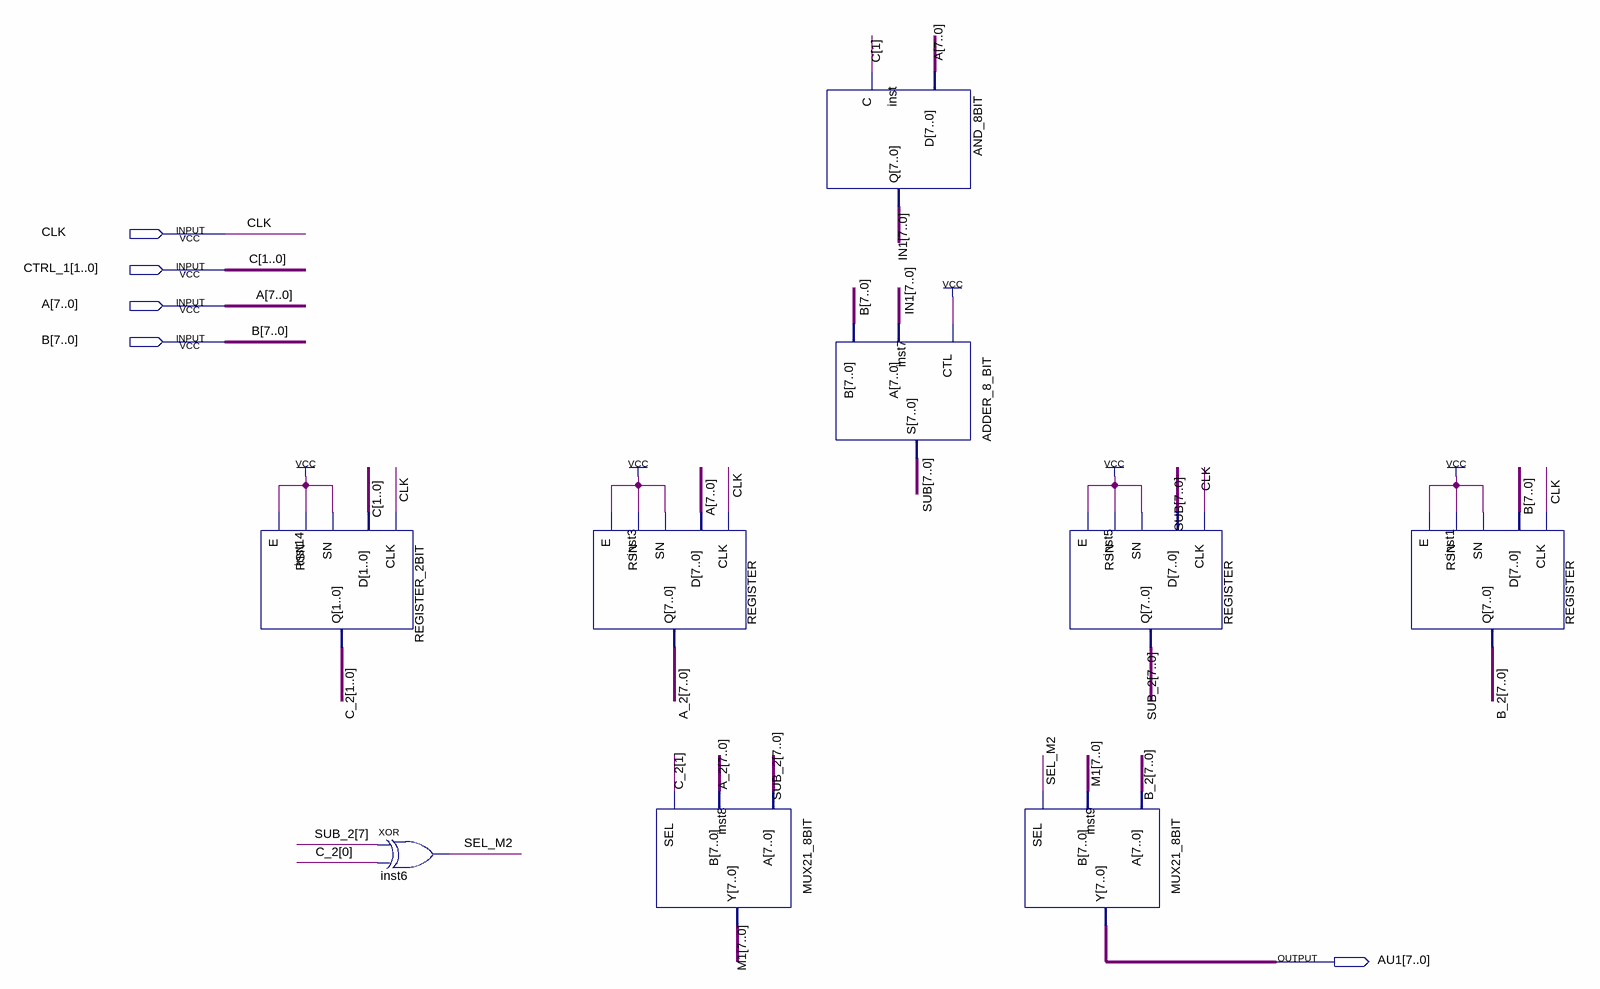
[diagram p0: schematic sheet]
// Quartus schematic AU1.bdf as structural Verilog: 9 symbols, 5 pins
module AU1 (
  input  CLK,
  input  [1:0] CTRL_1,
  input  [7:0] A,
  input  [7:0] B,
  output [7:0] AU1
);

  wire SEL_M2;
  wire [1:0] C_2;
  wire [7:0] A_2, B_2, IN1, M1, SUB, SUB_2;

  REGISTER_2BIT inst14 (.CLK(CLK), .D(CTRL_1), .SN(1'b1), .RSN(1'b1), .E(1'b1), .Q(C_2));
  xor inst6 (SEL_M2, SUB_2[7], C_2[0]);
  REGISTER inst3 (.CLK(CLK), .D(A), .SN(1'b1), .RSN(1'b1), .E(1'b1), .Q(A_2));
  MUX21_8BIT inst8 (.A(SUB_2), .B(A_2), .SEL(C_2[1]), .Y(M1));
  AND_8BIT inst (.D(A), .C(CTRL_1[1]), .Q(IN1));
  ADDER_8_BIT inst7 (.CTL(1'b1), .A(IN1), .B(B), .S(SUB));
  REGISTER inst5 (.CLK(CLK), .D(SUB), .SN(1'b1), .RSN(1'b1), .E(1'b1), .Q(SUB_2));
  MUX21_8BIT inst9 (.A(B_2), .B(M1), .SEL(SEL_M2), .Y(AU1));
  REGISTER inst1 (.CLK(CLK), .D(B), .SN(1'b1), .RSN(1'b1), .E(1'b1), .Q(B_2));

  // Other names for the same wires on the sheet: C[1:0] = CTRL_1
endmodule
